# Altium schematic sheet Skematic AT89C51.SchDoc
size A4; PageSetup: Record=PageOptions|CenterHorizontal=True|CenterVertical=True|PrintScale=1.00|XCorrection=1.00|YCorrection=1.00|PrintKind=2|BorderSize=5000000|LeftOffset=0|BottomOffset=0|Orientation=2|PaperLength=2970|PaperWidth=2100|Scale=100|PaperSource=7|PrintQuality=-3|MediaType=1|DitherType=10|PrintScaleMode=1|PaperKind=A4|PaperIndex=9
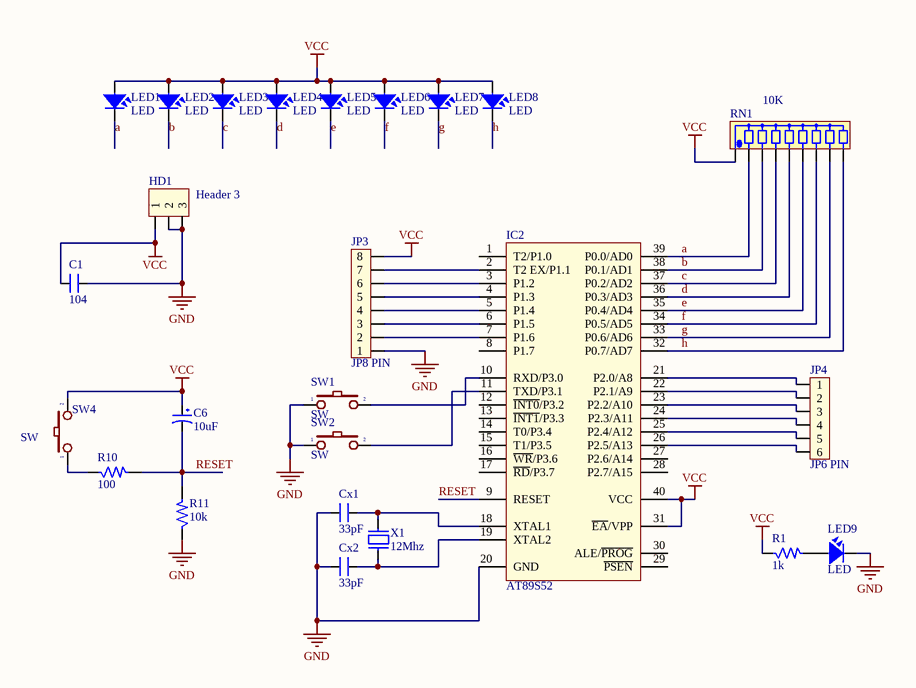
[diagram p0: Skematic AT89C51.SchDoc]

## Parts
C1  104  [CN2]
C6  10uF  [CP1/2]
Cx1  33pF  [CN1]
Cx2  33pF  [CN1]
HD1  Header 3  [HED3T]
IC2  AT89S52  [DIP40/W0.6]
JP3  JP8 PIN  [JP8]
JP4  JP6 PIN  [JP6]
LED1  LED  [LED-3]
LED2  LED  [LED-3]
LED3  LED  [LED-3]
LED4  LED  [LED-3]
LED5  LED  [LED-3]
LED6  LED  [LED-3]
LED7  LED  [LED-3]
LED8  LED  [LED-3]
LED9  LED  [LED-3]
R1  1k  [R1/4W]
R10  100  [R1/4W]
R11  10k  [R1/4W]
RN1  10K  [RN8]
SW1  SW  [SW2]
SW2  SW  [SW2]
SW4  SW  [SW2]
X1  12Mhz  [XT2]

## Nets
GND: C1.2 Cx1.2 Cx2.1 HD1.2 HD1.3 IC2.20(GND) JP3.1 LED9.2 R11.1 SW1.1 SW2.1
VCC: C1.1 C6.1 HD1.1 IC2.31(~{EA}/VPP) IC2.40(VCC) JP3.8 LED1.1 LED2.1 LED3.1 LED4.1 LED5.1 LED6.1 LED7.1 LED8.1 R1.1 RN1.1 SW4.2
a: IC2.39(P0.0/AD0) LED1.2 RN1.2
b: IC2.38(P0.1/AD1) LED2.2 RN1.3
c: IC2.37(P0.2/AD2) LED3.2 RN1.4
d: IC2.36(P0.3/AD3) LED4.2 RN1.5
e: IC2.35(P0.4/AD4) LED5.2 RN1.6
f: IC2.34(P0.5/AD5) LED6.2 RN1.7
g: IC2.33(P0.6/AD6) LED7.2 RN1.8
h: IC2.32(P0.7/AD7) LED8.2 RN1.9
RESET: C6.2 IC2.9(RESET) R10.2 R11.2
NetCx1_1: Cx1.1 IC2.18(XTAL1) X1.2
NetCx2_2: Cx2.2 IC2.19(XTAL2) X1.1
NetIC2_2: IC2.2(T2_EX/P1.1) JP3.7
NetIC2_3: IC2.3(P1.2) JP3.6
NetIC2_4: IC2.4(P1.3) JP3.5
NetIC2_5: IC2.5(P1.4) JP3.4
NetIC2_6: IC2.6(P1.5) JP3.3
NetIC2_7: IC2.7(P1.6) JP3.2
NetIC2_10: IC2.10(RXD/P3.0) SW1.2
NetIC2_11: IC2.11(TXD/P3.1) SW2.2
NetIC2_21: IC2.21(P2.0/A8) JP4.1
NetIC2_22: IC2.22(P2.1/A9) JP4.2
NetIC2_23: IC2.23(P2.2/A10) JP4.3
NetIC2_24: IC2.24(P2.3/A11) JP4.4
NetIC2_25: IC2.25(P2.4/A12) JP4.5
NetIC2_26: IC2.26(P2.5/A13) JP4.6
NetLED9_1: LED9.1 R1.2
NetR10_1: R10.1 SW4.1

Not connected (* = marked no-connect by the designer): IC2 1(T2/P1.0) 8(P1.7) 12(~{INT0}/P3.2) 13(~{INT1}/P3.3) 14(T0/P3.4) 15(T1/P3.5) 16(~{WR}/P3.6) 17(~{RD}/P3.7) 27(P2.6/A14) 28(P2.7/A15) 29(~{PSEN}) 30(ALE/~{PROG})

## Library data of the parts
C1 = CN2: Cap np 104 => 105pF; Value: 0.1uF
C6 = CP1: Cap P  0,1uF < 22uF , 16 - 50V; Value: 10uF/50V; Description 1: 10 => 220uF/6,3V/10V - 10uF => 100uF/16V; Description 2: 0,1uF => 33uF/50V - 10uF => 22uF/63V; Description 3: 0,47uF => 10uF/100V
Cx1 Cx2 = CN0: Cremic For Xtal 1pF => 100pF; Value: 33pF
HD1 = Hed3: Header 3 (Green); Value: Header 3
IC2 = AT89C52: Atmel AT89C52, 8k Byte Flash Memory , 40 Pin; Value: AT89C52
JP3 = JP8: Value: JP7
JP4 = JP6: Value: JP7
LED1-LED9 = LED: LED Single colour Green and Red; Value: LED 3 ly Single Colour
R1 R10 R11 = R: Resistor 1/4W; Value: R1/4W - 1K
RN1 = RN8: Resistor 8 (Thanh); Value: Tro thanh 10K
SW1 SW2 SW4 = SW2: Switch button 2 pin; Value: SW chip 2 pin
X1 = XT2: Crystal For all Crystal 2pin.; Value: 4Mhz